# Altium schematic sheet LCD.SchDoc
size A; SheetNumber: 9; SheetTotal: 10
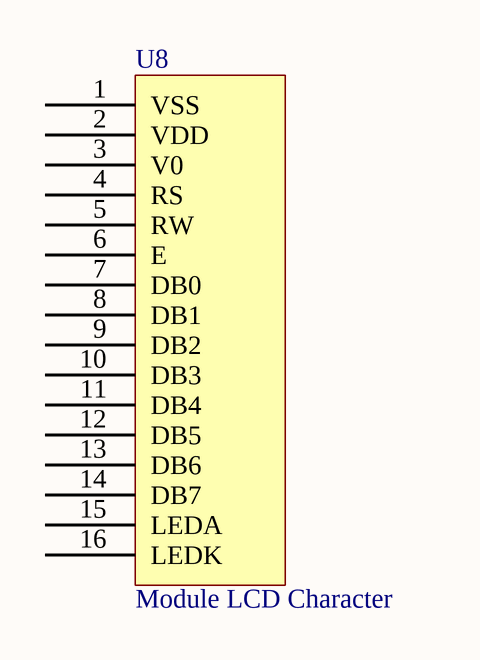
[diagram p0: LCD.SchDoc]

## Parts
U8  Module LCD Character  [LCD_1604]

## Nets

Not connected (* = marked no-connect by the designer): U8 1(VSS) 2(VDD) 3(V0) 4(RS) 5(RW) 6(E) 7(DB0) 8(DB1) 9(DB2) 10(DB3) 11(DB4) 12(DB5) 13(DB6) 14(DB7) 15(LEDA) 16(LEDK)

## Library data of the parts
U8 = Module LCD Character: Interface GPIO